# EasyEDA schematic easyEDA.json
TITLE: Sheet_1; REV: 1.0; Date: 2026-10-07; Sheet: 1/1; Drawn By: Farouk; Company: Your Company
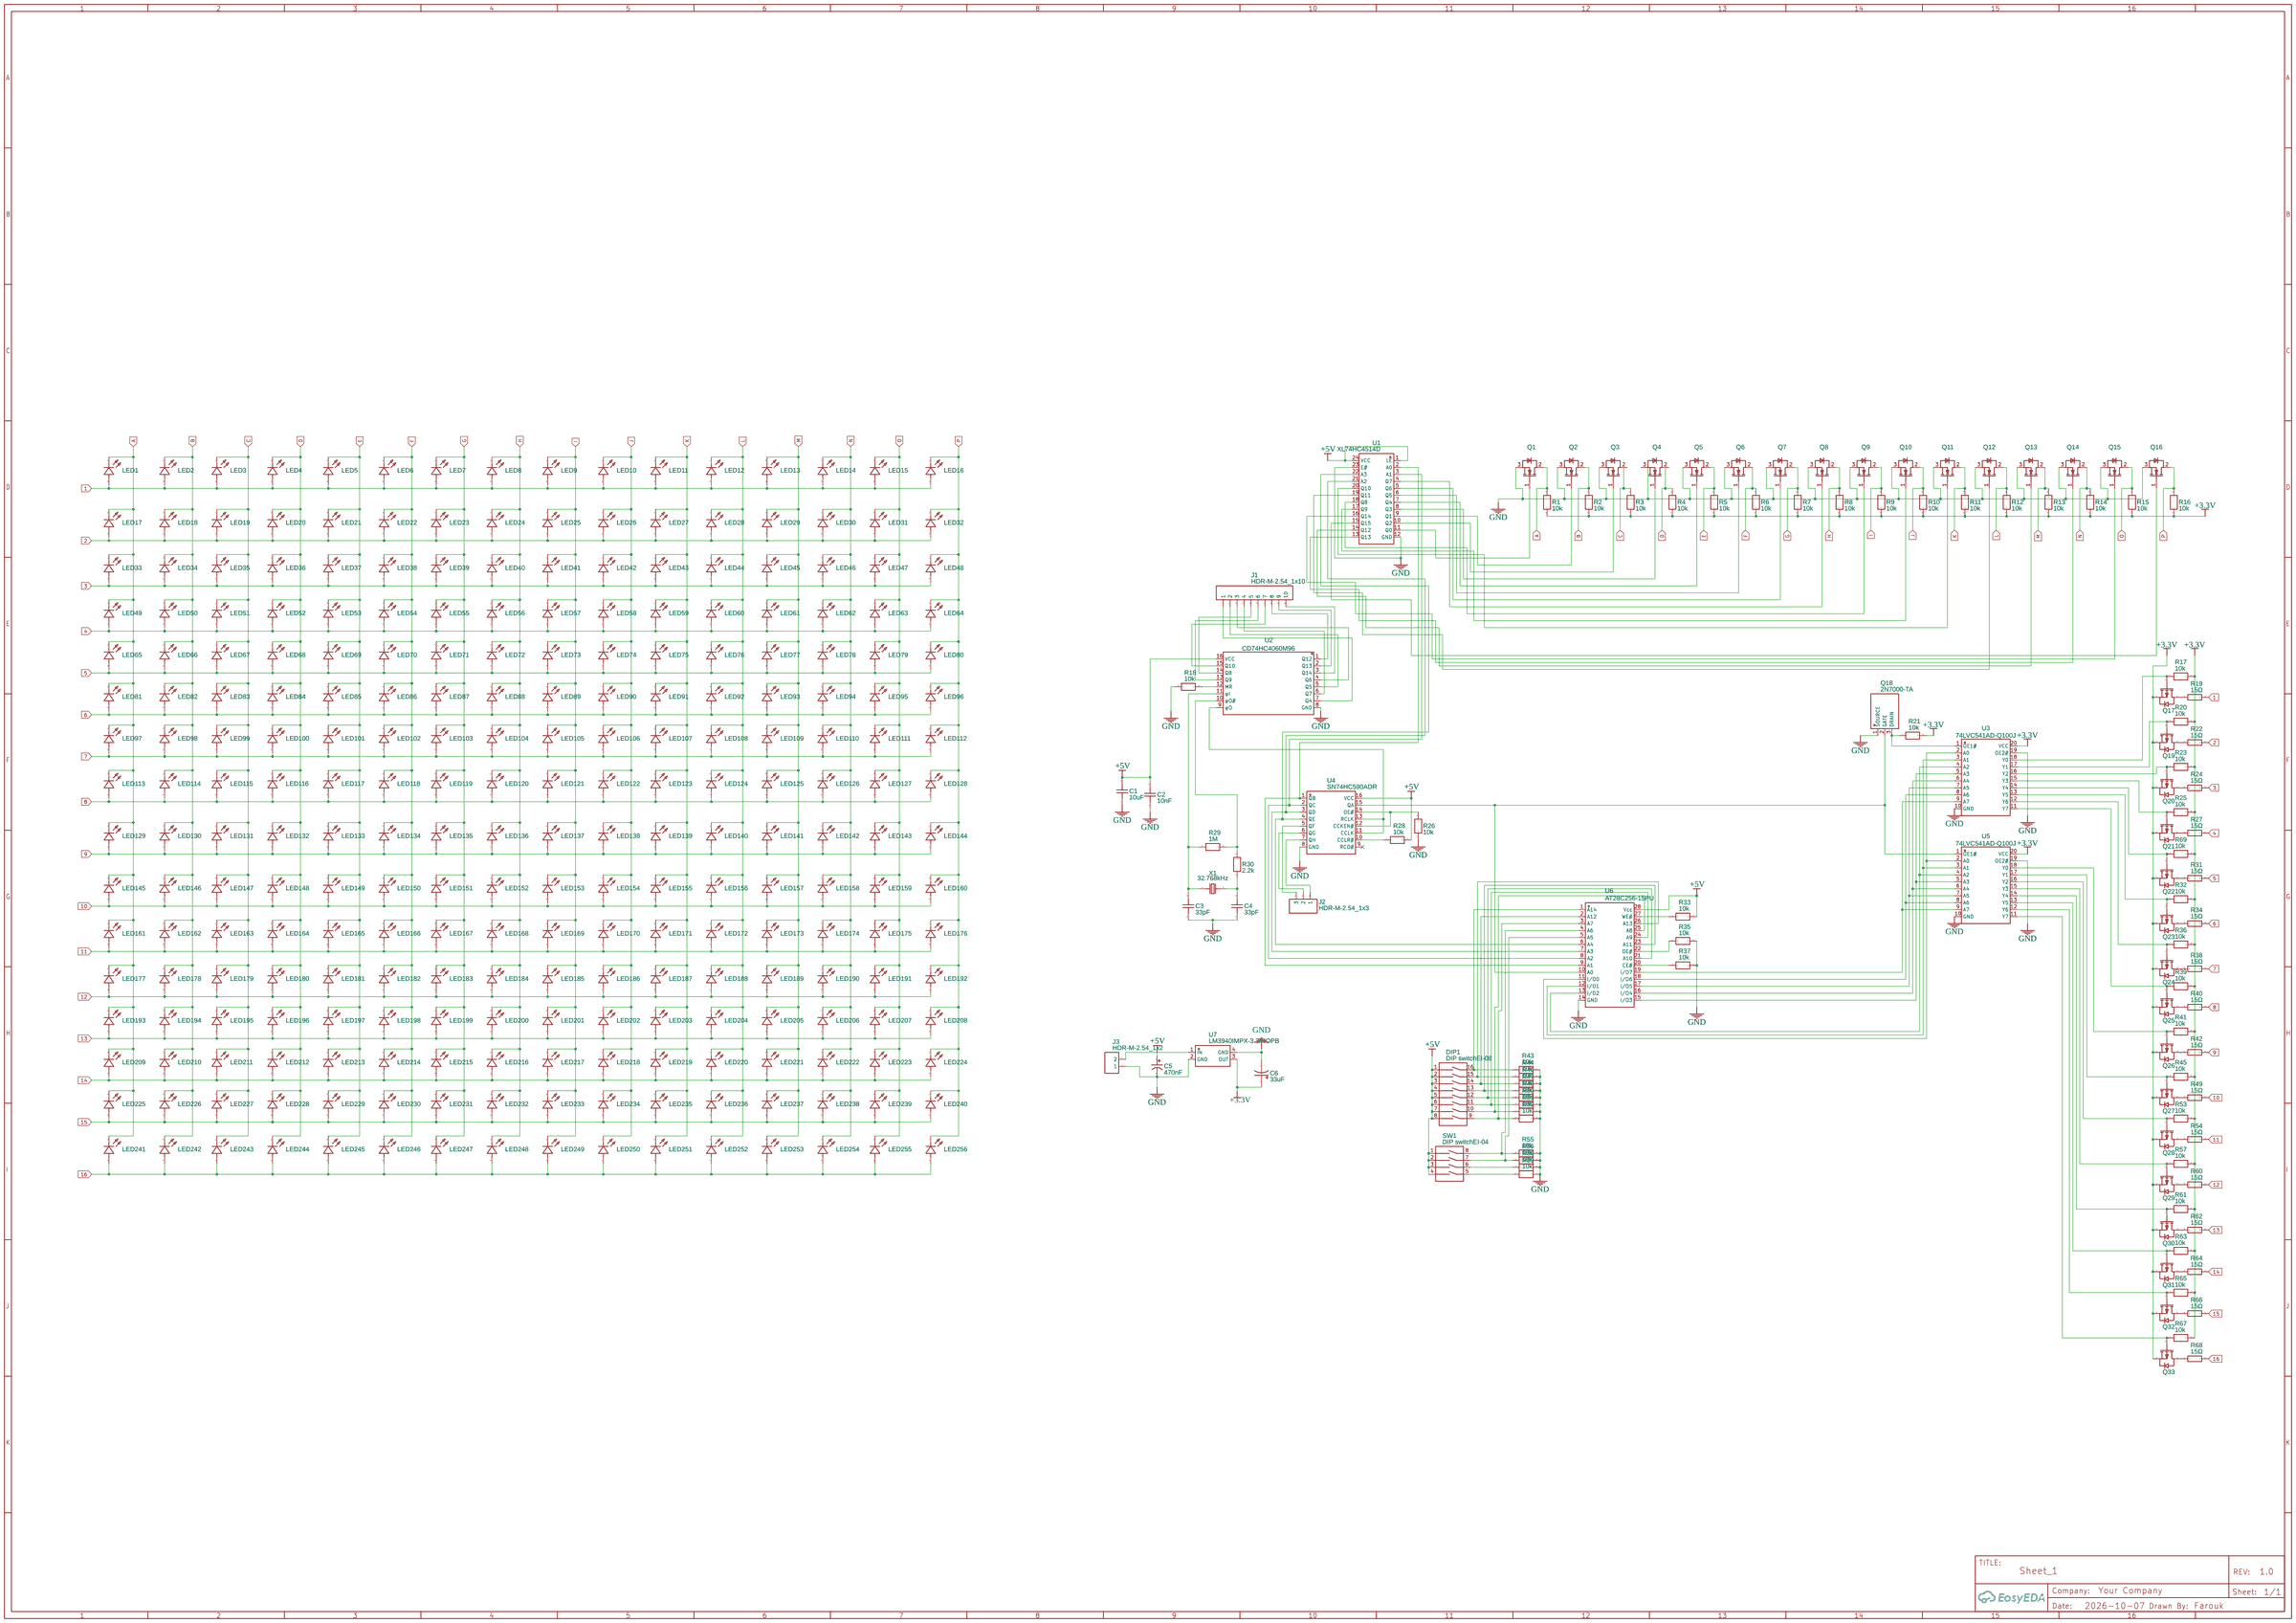
[diagram p0: schematic sheet]

## Parts
C1  10uF  [C1210]
C2  10nF  [C0805]
C3  33pF  [C0805]
C4  33pF  [C0805]
C5  470nF  [CAP-TH_BD4.0-P1.50-D0.8-FD]
C6  33uF  [CAP-TH_BD6.3-P2.50-D0.5-FD]
DIP1  DIP switchEI-08  [SW-TH_16P-L20.5-W6.0-P2.54]
J1  HDR-M-2.54_1x10  [HDR-M-2.54_1X10]
J2  HDR-M-2.54_1x3  [HDR-M-2.54_1X3]
J3  HDR-M-2.54_1x2  [HDR-M-2.54_1X2]
LED1  42-21A/GHC-YX1Y2N/1T  [LED-SMD_L3.2-W2.4-R_GREEN]
LED2  42-21A/GHC-YX1Y2N/1T  [LED-SMD_L3.2-W2.4-R_GREEN]
LED3  42-21A/GHC-YX1Y2N/1T  [LED-SMD_L3.2-W2.4-R_GREEN]
LED4  42-21A/GHC-YX1Y2N/1T  [LED-SMD_L3.2-W2.4-R_GREEN]
LED5  42-21A/GHC-YX1Y2N/1T  [LED-SMD_L3.2-W2.4-R_GREEN]
LED6  42-21A/GHC-YX1Y2N/1T  [LED-SMD_L3.2-W2.4-R_GREEN]
LED7  42-21A/GHC-YX1Y2N/1T  [LED-SMD_L3.2-W2.4-R_GREEN]
LED8  42-21A/GHC-YX1Y2N/1T  [LED-SMD_L3.2-W2.4-R_GREEN]
LED9  42-21A/GHC-YX1Y2N/1T  [LED-SMD_L3.2-W2.4-R_GREEN]
LED10  42-21A/GHC-YX1Y2N/1T  [LED-SMD_L3.2-W2.4-R_GREEN]
LED11  42-21A/GHC-YX1Y2N/1T  [LED-SMD_L3.2-W2.4-R_GREEN]
LED12  42-21A/GHC-YX1Y2N/1T  [LED-SMD_L3.2-W2.4-R_GREEN]
LED13  42-21A/GHC-YX1Y2N/1T  [LED-SMD_L3.2-W2.4-R_GREEN]
LED14  42-21A/GHC-YX1Y2N/1T  [LED-SMD_L3.2-W2.4-R_GREEN]
LED15  42-21A/GHC-YX1Y2N/1T  [LED-SMD_L3.2-W2.4-R_GREEN]
LED16  42-21A/GHC-YX1Y2N/1T  [LED-SMD_L3.2-W2.4-R_GREEN]
LED17  42-21A/GHC-YX1Y2N/1T  [LED-SMD_L3.2-W2.4-R_GREEN]
LED18  42-21A/GHC-YX1Y2N/1T  [LED-SMD_L3.2-W2.4-R_GREEN]
LED19  42-21A/GHC-YX1Y2N/1T  [LED-SMD_L3.2-W2.4-R_GREEN]
LED20  42-21A/GHC-YX1Y2N/1T  [LED-SMD_L3.2-W2.4-R_GREEN]
LED21  42-21A/GHC-YX1Y2N/1T  [LED-SMD_L3.2-W2.4-R_GREEN]
LED22  42-21A/GHC-YX1Y2N/1T  [LED-SMD_L3.2-W2.4-R_GREEN]
LED23  42-21A/GHC-YX1Y2N/1T  [LED-SMD_L3.2-W2.4-R_GREEN]
LED24  42-21A/GHC-YX1Y2N/1T  [LED-SMD_L3.2-W2.4-R_GREEN]
LED25  42-21A/GHC-YX1Y2N/1T  [LED-SMD_L3.2-W2.4-R_GREEN]
LED26  42-21A/GHC-YX1Y2N/1T  [LED-SMD_L3.2-W2.4-R_GREEN]
LED27  42-21A/GHC-YX1Y2N/1T  [LED-SMD_L3.2-W2.4-R_GREEN]
LED28  42-21A/GHC-YX1Y2N/1T  [LED-SMD_L3.2-W2.4-R_GREEN]
LED29  42-21A/GHC-YX1Y2N/1T  [LED-SMD_L3.2-W2.4-R_GREEN]
LED30  42-21A/GHC-YX1Y2N/1T  [LED-SMD_L3.2-W2.4-R_GREEN]
LED31  42-21A/GHC-YX1Y2N/1T  [LED-SMD_L3.2-W2.4-R_GREEN]
LED32  42-21A/GHC-YX1Y2N/1T  [LED-SMD_L3.2-W2.4-R_GREEN]
LED33  42-21A/GHC-YX1Y2N/1T  [LED-SMD_L3.2-W2.4-R_GREEN]
LED34  42-21A/GHC-YX1Y2N/1T  [LED-SMD_L3.2-W2.4-R_GREEN]
LED35  42-21A/GHC-YX1Y2N/1T  [LED-SMD_L3.2-W2.4-R_GREEN]
LED36  42-21A/GHC-YX1Y2N/1T  [LED-SMD_L3.2-W2.4-R_GREEN]
LED37  42-21A/GHC-YX1Y2N/1T  [LED-SMD_L3.2-W2.4-R_GREEN]
LED38  42-21A/GHC-YX1Y2N/1T  [LED-SMD_L3.2-W2.4-R_GREEN]
LED39  42-21A/GHC-YX1Y2N/1T  [LED-SMD_L3.2-W2.4-R_GREEN]
LED40  42-21A/GHC-YX1Y2N/1T  [LED-SMD_L3.2-W2.4-R_GREEN]
LED41  42-21A/GHC-YX1Y2N/1T  [LED-SMD_L3.2-W2.4-R_GREEN]
LED42  42-21A/GHC-YX1Y2N/1T  [LED-SMD_L3.2-W2.4-R_GREEN]
LED43  42-21A/GHC-YX1Y2N/1T  [LED-SMD_L3.2-W2.4-R_GREEN]
LED44  42-21A/GHC-YX1Y2N/1T  [LED-SMD_L3.2-W2.4-R_GREEN]
LED45  42-21A/GHC-YX1Y2N/1T  [LED-SMD_L3.2-W2.4-R_GREEN]
LED46  42-21A/GHC-YX1Y2N/1T  [LED-SMD_L3.2-W2.4-R_GREEN]
LED47  42-21A/GHC-YX1Y2N/1T  [LED-SMD_L3.2-W2.4-R_GREEN]
LED48  42-21A/GHC-YX1Y2N/1T  [LED-SMD_L3.2-W2.4-R_GREEN]
LED49  42-21A/GHC-YX1Y2N/1T  [LED-SMD_L3.2-W2.4-R_GREEN]
LED50  42-21A/GHC-YX1Y2N/1T  [LED-SMD_L3.2-W2.4-R_GREEN]
LED51  42-21A/GHC-YX1Y2N/1T  [LED-SMD_L3.2-W2.4-R_GREEN]
LED52  42-21A/GHC-YX1Y2N/1T  [LED-SMD_L3.2-W2.4-R_GREEN]
LED53  42-21A/GHC-YX1Y2N/1T  [LED-SMD_L3.2-W2.4-R_GREEN]
LED54  42-21A/GHC-YX1Y2N/1T  [LED-SMD_L3.2-W2.4-R_GREEN]
LED55  42-21A/GHC-YX1Y2N/1T  [LED-SMD_L3.2-W2.4-R_GREEN]
LED56  42-21A/GHC-YX1Y2N/1T  [LED-SMD_L3.2-W2.4-R_GREEN]
LED57  42-21A/GHC-YX1Y2N/1T  [LED-SMD_L3.2-W2.4-R_GREEN]
LED58  42-21A/GHC-YX1Y2N/1T  [LED-SMD_L3.2-W2.4-R_GREEN]
LED59  42-21A/GHC-YX1Y2N/1T  [LED-SMD_L3.2-W2.4-R_GREEN]
LED60  42-21A/GHC-YX1Y2N/1T  [LED-SMD_L3.2-W2.4-R_GREEN]
LED61  42-21A/GHC-YX1Y2N/1T  [LED-SMD_L3.2-W2.4-R_GREEN]
LED62  42-21A/GHC-YX1Y2N/1T  [LED-SMD_L3.2-W2.4-R_GREEN]
LED63  42-21A/GHC-YX1Y2N/1T  [LED-SMD_L3.2-W2.4-R_GREEN]
LED64  42-21A/GHC-YX1Y2N/1T  [LED-SMD_L3.2-W2.4-R_GREEN]
LED65  42-21A/GHC-YX1Y2N/1T  [LED-SMD_L3.2-W2.4-R_GREEN]
LED66  42-21A/GHC-YX1Y2N/1T  [LED-SMD_L3.2-W2.4-R_GREEN]
LED67  42-21A/GHC-YX1Y2N/1T  [LED-SMD_L3.2-W2.4-R_GREEN]
LED68  42-21A/GHC-YX1Y2N/1T  [LED-SMD_L3.2-W2.4-R_GREEN]
LED69  42-21A/GHC-YX1Y2N/1T  [LED-SMD_L3.2-W2.4-R_GREEN]
LED70  42-21A/GHC-YX1Y2N/1T  [LED-SMD_L3.2-W2.4-R_GREEN]
LED71  42-21A/GHC-YX1Y2N/1T  [LED-SMD_L3.2-W2.4-R_GREEN]
LED72  42-21A/GHC-YX1Y2N/1T  [LED-SMD_L3.2-W2.4-R_GREEN]
LED73  42-21A/GHC-YX1Y2N/1T  [LED-SMD_L3.2-W2.4-R_GREEN]
LED74  42-21A/GHC-YX1Y2N/1T  [LED-SMD_L3.2-W2.4-R_GREEN]
LED75  42-21A/GHC-YX1Y2N/1T  [LED-SMD_L3.2-W2.4-R_GREEN]
LED76  42-21A/GHC-YX1Y2N/1T  [LED-SMD_L3.2-W2.4-R_GREEN]
LED77  42-21A/GHC-YX1Y2N/1T  [LED-SMD_L3.2-W2.4-R_GREEN]
LED78  42-21A/GHC-YX1Y2N/1T  [LED-SMD_L3.2-W2.4-R_GREEN]
LED79  42-21A/GHC-YX1Y2N/1T  [LED-SMD_L3.2-W2.4-R_GREEN]
LED80  42-21A/GHC-YX1Y2N/1T  [LED-SMD_L3.2-W2.4-R_GREEN]
LED81  42-21A/GHC-YX1Y2N/1T  [LED-SMD_L3.2-W2.4-R_GREEN]
LED82  42-21A/GHC-YX1Y2N/1T  [LED-SMD_L3.2-W2.4-R_GREEN]
LED83  42-21A/GHC-YX1Y2N/1T  [LED-SMD_L3.2-W2.4-R_GREEN]
LED84  42-21A/GHC-YX1Y2N/1T  [LED-SMD_L3.2-W2.4-R_GREEN]
LED85  42-21A/GHC-YX1Y2N/1T  [LED-SMD_L3.2-W2.4-R_GREEN]
LED86  42-21A/GHC-YX1Y2N/1T  [LED-SMD_L3.2-W2.4-R_GREEN]
LED87  42-21A/GHC-YX1Y2N/1T  [LED-SMD_L3.2-W2.4-R_GREEN]
LED88  42-21A/GHC-YX1Y2N/1T  [LED-SMD_L3.2-W2.4-R_GREEN]
LED89  42-21A/GHC-YX1Y2N/1T  [LED-SMD_L3.2-W2.4-R_GREEN]
LED90  42-21A/GHC-YX1Y2N/1T  [LED-SMD_L3.2-W2.4-R_GREEN]
LED91  42-21A/GHC-YX1Y2N/1T  [LED-SMD_L3.2-W2.4-R_GREEN]
LED92  42-21A/GHC-YX1Y2N/1T  [LED-SMD_L3.2-W2.4-R_GREEN]
LED93  42-21A/GHC-YX1Y2N/1T  [LED-SMD_L3.2-W2.4-R_GREEN]
LED94  42-21A/GHC-YX1Y2N/1T  [LED-SMD_L3.2-W2.4-R_GREEN]
LED95  42-21A/GHC-YX1Y2N/1T  [LED-SMD_L3.2-W2.4-R_GREEN]
LED96  42-21A/GHC-YX1Y2N/1T  [LED-SMD_L3.2-W2.4-R_GREEN]
LED97  42-21A/GHC-YX1Y2N/1T  [LED-SMD_L3.2-W2.4-R_GREEN]
LED98  42-21A/GHC-YX1Y2N/1T  [LED-SMD_L3.2-W2.4-R_GREEN]
LED99  42-21A/GHC-YX1Y2N/1T  [LED-SMD_L3.2-W2.4-R_GREEN]
LED100  42-21A/GHC-YX1Y2N/1T  [LED-SMD_L3.2-W2.4-R_GREEN]
LED101  42-21A/GHC-YX1Y2N/1T  [LED-SMD_L3.2-W2.4-R_GREEN]
LED102  42-21A/GHC-YX1Y2N/1T  [LED-SMD_L3.2-W2.4-R_GREEN]
LED103  42-21A/GHC-YX1Y2N/1T  [LED-SMD_L3.2-W2.4-R_GREEN]
LED104  42-21A/GHC-YX1Y2N/1T  [LED-SMD_L3.2-W2.4-R_GREEN]
LED105  42-21A/GHC-YX1Y2N/1T  [LED-SMD_L3.2-W2.4-R_GREEN]
LED106  42-21A/GHC-YX1Y2N/1T  [LED-SMD_L3.2-W2.4-R_GREEN]
LED107  42-21A/GHC-YX1Y2N/1T  [LED-SMD_L3.2-W2.4-R_GREEN]
LED108  42-21A/GHC-YX1Y2N/1T  [LED-SMD_L3.2-W2.4-R_GREEN]
LED109  42-21A/GHC-YX1Y2N/1T  [LED-SMD_L3.2-W2.4-R_GREEN]
LED110  42-21A/GHC-YX1Y2N/1T  [LED-SMD_L3.2-W2.4-R_GREEN]
LED111  42-21A/GHC-YX1Y2N/1T  [LED-SMD_L3.2-W2.4-R_GREEN]
LED112  42-21A/GHC-YX1Y2N/1T  [LED-SMD_L3.2-W2.4-R_GREEN]
LED113  42-21A/GHC-YX1Y2N/1T  [LED-SMD_L3.2-W2.4-R_GREEN]
LED114  42-21A/GHC-YX1Y2N/1T  [LED-SMD_L3.2-W2.4-R_GREEN]
LED115  42-21A/GHC-YX1Y2N/1T  [LED-SMD_L3.2-W2.4-R_GREEN]
LED116  42-21A/GHC-YX1Y2N/1T  [LED-SMD_L3.2-W2.4-R_GREEN]
LED117  42-21A/GHC-YX1Y2N/1T  [LED-SMD_L3.2-W2.4-R_GREEN]
LED118  42-21A/GHC-YX1Y2N/1T  [LED-SMD_L3.2-W2.4-R_GREEN]
LED119  42-21A/GHC-YX1Y2N/1T  [LED-SMD_L3.2-W2.4-R_GREEN]
LED120  42-21A/GHC-YX1Y2N/1T  [LED-SMD_L3.2-W2.4-R_GREEN]
LED121  42-21A/GHC-YX1Y2N/1T  [LED-SMD_L3.2-W2.4-R_GREEN]
LED122  42-21A/GHC-YX1Y2N/1T  [LED-SMD_L3.2-W2.4-R_GREEN]
LED123  42-21A/GHC-YX1Y2N/1T  [LED-SMD_L3.2-W2.4-R_GREEN]
LED124  42-21A/GHC-YX1Y2N/1T  [LED-SMD_L3.2-W2.4-R_GREEN]
LED125  42-21A/GHC-YX1Y2N/1T  [LED-SMD_L3.2-W2.4-R_GREEN]
LED126  42-21A/GHC-YX1Y2N/1T  [LED-SMD_L3.2-W2.4-R_GREEN]
LED127  42-21A/GHC-YX1Y2N/1T  [LED-SMD_L3.2-W2.4-R_GREEN]
LED128  42-21A/GHC-YX1Y2N/1T  [LED-SMD_L3.2-W2.4-R_GREEN]
LED129  42-21A/GHC-YX1Y2N/1T  [LED-SMD_L3.2-W2.4-R_GREEN]
LED130  42-21A/GHC-YX1Y2N/1T  [LED-SMD_L3.2-W2.4-R_GREEN]
LED131  42-21A/GHC-YX1Y2N/1T  [LED-SMD_L3.2-W2.4-R_GREEN]
LED132  42-21A/GHC-YX1Y2N/1T  [LED-SMD_L3.2-W2.4-R_GREEN]
LED133  42-21A/GHC-YX1Y2N/1T  [LED-SMD_L3.2-W2.4-R_GREEN]
LED134  42-21A/GHC-YX1Y2N/1T  [LED-SMD_L3.2-W2.4-R_GREEN]
LED135  42-21A/GHC-YX1Y2N/1T  [LED-SMD_L3.2-W2.4-R_GREEN]
LED136  42-21A/GHC-YX1Y2N/1T  [LED-SMD_L3.2-W2.4-R_GREEN]
LED137  42-21A/GHC-YX1Y2N/1T  [LED-SMD_L3.2-W2.4-R_GREEN]
LED138  42-21A/GHC-YX1Y2N/1T  [LED-SMD_L3.2-W2.4-R_GREEN]
LED139  42-21A/GHC-YX1Y2N/1T  [LED-SMD_L3.2-W2.4-R_GREEN]
LED140  42-21A/GHC-YX1Y2N/1T  [LED-SMD_L3.2-W2.4-R_GREEN]
LED141  42-21A/GHC-YX1Y2N/1T  [LED-SMD_L3.2-W2.4-R_GREEN]
LED142  42-21A/GHC-YX1Y2N/1T  [LED-SMD_L3.2-W2.4-R_GREEN]
LED143  42-21A/GHC-YX1Y2N/1T  [LED-SMD_L3.2-W2.4-R_GREEN]
LED144  42-21A/GHC-YX1Y2N/1T  [LED-SMD_L3.2-W2.4-R_GREEN]
LED145  42-21A/GHC-YX1Y2N/1T  [LED-SMD_L3.2-W2.4-R_GREEN]
LED146  42-21A/GHC-YX1Y2N/1T  [LED-SMD_L3.2-W2.4-R_GREEN]
LED147  42-21A/GHC-YX1Y2N/1T  [LED-SMD_L3.2-W2.4-R_GREEN]
LED148  42-21A/GHC-YX1Y2N/1T  [LED-SMD_L3.2-W2.4-R_GREEN]
LED149  42-21A/GHC-YX1Y2N/1T  [LED-SMD_L3.2-W2.4-R_GREEN]
LED150  42-21A/GHC-YX1Y2N/1T  [LED-SMD_L3.2-W2.4-R_GREEN]
LED151  42-21A/GHC-YX1Y2N/1T  [LED-SMD_L3.2-W2.4-R_GREEN]
LED152  42-21A/GHC-YX1Y2N/1T  [LED-SMD_L3.2-W2.4-R_GREEN]
LED153  42-21A/GHC-YX1Y2N/1T  [LED-SMD_L3.2-W2.4-R_GREEN]
LED154  42-21A/GHC-YX1Y2N/1T  [LED-SMD_L3.2-W2.4-R_GREEN]
LED155  42-21A/GHC-YX1Y2N/1T  [LED-SMD_L3.2-W2.4-R_GREEN]
LED156  42-21A/GHC-YX1Y2N/1T  [LED-SMD_L3.2-W2.4-R_GREEN]
LED157  42-21A/GHC-YX1Y2N/1T  [LED-SMD_L3.2-W2.4-R_GREEN]
LED158  42-21A/GHC-YX1Y2N/1T  [LED-SMD_L3.2-W2.4-R_GREEN]
LED159  42-21A/GHC-YX1Y2N/1T  [LED-SMD_L3.2-W2.4-R_GREEN]
LED160  42-21A/GHC-YX1Y2N/1T  [LED-SMD_L3.2-W2.4-R_GREEN]
LED161  42-21A/GHC-YX1Y2N/1T  [LED-SMD_L3.2-W2.4-R_GREEN]
LED162  42-21A/GHC-YX1Y2N/1T  [LED-SMD_L3.2-W2.4-R_GREEN]
LED163  42-21A/GHC-YX1Y2N/1T  [LED-SMD_L3.2-W2.4-R_GREEN]
LED164  42-21A/GHC-YX1Y2N/1T  [LED-SMD_L3.2-W2.4-R_GREEN]
LED165  42-21A/GHC-YX1Y2N/1T  [LED-SMD_L3.2-W2.4-R_GREEN]
LED166  42-21A/GHC-YX1Y2N/1T  [LED-SMD_L3.2-W2.4-R_GREEN]
LED167  42-21A/GHC-YX1Y2N/1T  [LED-SMD_L3.2-W2.4-R_GREEN]
LED168  42-21A/GHC-YX1Y2N/1T  [LED-SMD_L3.2-W2.4-R_GREEN]
LED169  42-21A/GHC-YX1Y2N/1T  [LED-SMD_L3.2-W2.4-R_GREEN]
LED170  42-21A/GHC-YX1Y2N/1T  [LED-SMD_L3.2-W2.4-R_GREEN]
LED171  42-21A/GHC-YX1Y2N/1T  [LED-SMD_L3.2-W2.4-R_GREEN]
LED172  42-21A/GHC-YX1Y2N/1T  [LED-SMD_L3.2-W2.4-R_GREEN]
LED173  42-21A/GHC-YX1Y2N/1T  [LED-SMD_L3.2-W2.4-R_GREEN]
LED174  42-21A/GHC-YX1Y2N/1T  [LED-SMD_L3.2-W2.4-R_GREEN]
LED175  42-21A/GHC-YX1Y2N/1T  [LED-SMD_L3.2-W2.4-R_GREEN]
LED176  42-21A/GHC-YX1Y2N/1T  [LED-SMD_L3.2-W2.4-R_GREEN]
LED177  42-21A/GHC-YX1Y2N/1T  [LED-SMD_L3.2-W2.4-R_GREEN]
LED178  42-21A/GHC-YX1Y2N/1T  [LED-SMD_L3.2-W2.4-R_GREEN]
LED179  42-21A/GHC-YX1Y2N/1T  [LED-SMD_L3.2-W2.4-R_GREEN]
LED180  42-21A/GHC-YX1Y2N/1T  [LED-SMD_L3.2-W2.4-R_GREEN]
LED181  42-21A/GHC-YX1Y2N/1T  [LED-SMD_L3.2-W2.4-R_GREEN]
LED182  42-21A/GHC-YX1Y2N/1T  [LED-SMD_L3.2-W2.4-R_GREEN]
LED183  42-21A/GHC-YX1Y2N/1T  [LED-SMD_L3.2-W2.4-R_GREEN]
LED184  42-21A/GHC-YX1Y2N/1T  [LED-SMD_L3.2-W2.4-R_GREEN]
LED185  42-21A/GHC-YX1Y2N/1T  [LED-SMD_L3.2-W2.4-R_GREEN]
LED186  42-21A/GHC-YX1Y2N/1T  [LED-SMD_L3.2-W2.4-R_GREEN]
LED187  42-21A/GHC-YX1Y2N/1T  [LED-SMD_L3.2-W2.4-R_GREEN]
LED188  42-21A/GHC-YX1Y2N/1T  [LED-SMD_L3.2-W2.4-R_GREEN]
LED189  42-21A/GHC-YX1Y2N/1T  [LED-SMD_L3.2-W2.4-R_GREEN]
LED190  42-21A/GHC-YX1Y2N/1T  [LED-SMD_L3.2-W2.4-R_GREEN]
LED191  42-21A/GHC-YX1Y2N/1T  [LED-SMD_L3.2-W2.4-R_GREEN]
LED192  42-21A/GHC-YX1Y2N/1T  [LED-SMD_L3.2-W2.4-R_GREEN]
LED193  42-21A/GHC-YX1Y2N/1T  [LED-SMD_L3.2-W2.4-R_GREEN]
LED194  42-21A/GHC-YX1Y2N/1T  [LED-SMD_L3.2-W2.4-R_GREEN]
LED195  42-21A/GHC-YX1Y2N/1T  [LED-SMD_L3.2-W2.4-R_GREEN]
LED196  42-21A/GHC-YX1Y2N/1T  [LED-SMD_L3.2-W2.4-R_GREEN]
LED197  42-21A/GHC-YX1Y2N/1T  [LED-SMD_L3.2-W2.4-R_GREEN]
LED198  42-21A/GHC-YX1Y2N/1T  [LED-SMD_L3.2-W2.4-R_GREEN]
LED199  42-21A/GHC-YX1Y2N/1T  [LED-SMD_L3.2-W2.4-R_GREEN]
LED200  42-21A/GHC-YX1Y2N/1T  [LED-SMD_L3.2-W2.4-R_GREEN]
LED201  42-21A/GHC-YX1Y2N/1T  [LED-SMD_L3.2-W2.4-R_GREEN]
LED202  42-21A/GHC-YX1Y2N/1T  [LED-SMD_L3.2-W2.4-R_GREEN]
LED203  42-21A/GHC-YX1Y2N/1T  [LED-SMD_L3.2-W2.4-R_GREEN]
LED204  42-21A/GHC-YX1Y2N/1T  [LED-SMD_L3.2-W2.4-R_GREEN]
LED205  42-21A/GHC-YX1Y2N/1T  [LED-SMD_L3.2-W2.4-R_GREEN]
LED206  42-21A/GHC-YX1Y2N/1T  [LED-SMD_L3.2-W2.4-R_GREEN]
LED207  42-21A/GHC-YX1Y2N/1T  [LED-SMD_L3.2-W2.4-R_GREEN]
LED208  42-21A/GHC-YX1Y2N/1T  [LED-SMD_L3.2-W2.4-R_GREEN]
LED209  42-21A/GHC-YX1Y2N/1T  [LED-SMD_L3.2-W2.4-R_GREEN]
LED210  42-21A/GHC-YX1Y2N/1T  [LED-SMD_L3.2-W2.4-R_GREEN]
LED211  42-21A/GHC-YX1Y2N/1T  [LED-SMD_L3.2-W2.4-R_GREEN]
LED212  42-21A/GHC-YX1Y2N/1T  [LED-SMD_L3.2-W2.4-R_GREEN]
LED213  42-21A/GHC-YX1Y2N/1T  [LED-SMD_L3.2-W2.4-R_GREEN]
LED214  42-21A/GHC-YX1Y2N/1T  [LED-SMD_L3.2-W2.4-R_GREEN]
LED215  42-21A/GHC-YX1Y2N/1T  [LED-SMD_L3.2-W2.4-R_GREEN]
LED216  42-21A/GHC-YX1Y2N/1T  [LED-SMD_L3.2-W2.4-R_GREEN]
LED217  42-21A/GHC-YX1Y2N/1T  [LED-SMD_L3.2-W2.4-R_GREEN]
LED218  42-21A/GHC-YX1Y2N/1T  [LED-SMD_L3.2-W2.4-R_GREEN]
LED219  42-21A/GHC-YX1Y2N/1T  [LED-SMD_L3.2-W2.4-R_GREEN]
LED220  42-21A/GHC-YX1Y2N/1T  [LED-SMD_L3.2-W2.4-R_GREEN]
LED221  42-21A/GHC-YX1Y2N/1T  [LED-SMD_L3.2-W2.4-R_GREEN]
LED222  42-21A/GHC-YX1Y2N/1T  [LED-SMD_L3.2-W2.4-R_GREEN]
LED223  42-21A/GHC-YX1Y2N/1T  [LED-SMD_L3.2-W2.4-R_GREEN]
LED224  42-21A/GHC-YX1Y2N/1T  [LED-SMD_L3.2-W2.4-R_GREEN]
LED225  42-21A/GHC-YX1Y2N/1T  [LED-SMD_L3.2-W2.4-R_GREEN]
LED226  42-21A/GHC-YX1Y2N/1T  [LED-SMD_L3.2-W2.4-R_GREEN]
LED227  42-21A/GHC-YX1Y2N/1T  [LED-SMD_L3.2-W2.4-R_GREEN]
LED228  42-21A/GHC-YX1Y2N/1T  [LED-SMD_L3.2-W2.4-R_GREEN]
LED229  42-21A/GHC-YX1Y2N/1T  [LED-SMD_L3.2-W2.4-R_GREEN]
LED230  42-21A/GHC-YX1Y2N/1T  [LED-SMD_L3.2-W2.4-R_GREEN]
LED231  42-21A/GHC-YX1Y2N/1T  [LED-SMD_L3.2-W2.4-R_GREEN]
LED232  42-21A/GHC-YX1Y2N/1T  [LED-SMD_L3.2-W2.4-R_GREEN]
LED233  42-21A/GHC-YX1Y2N/1T  [LED-SMD_L3.2-W2.4-R_GREEN]
LED234  42-21A/GHC-YX1Y2N/1T  [LED-SMD_L3.2-W2.4-R_GREEN]
LED235  42-21A/GHC-YX1Y2N/1T  [LED-SMD_L3.2-W2.4-R_GREEN]
LED236  42-21A/GHC-YX1Y2N/1T  [LED-SMD_L3.2-W2.4-R_GREEN]
LED237  42-21A/GHC-YX1Y2N/1T  [LED-SMD_L3.2-W2.4-R_GREEN]
LED238  42-21A/GHC-YX1Y2N/1T  [LED-SMD_L3.2-W2.4-R_GREEN]
LED239  42-21A/GHC-YX1Y2N/1T  [LED-SMD_L3.2-W2.4-R_GREEN]
LED240  42-21A/GHC-YX1Y2N/1T  [LED-SMD_L3.2-W2.4-R_GREEN]
LED241  42-21A/GHC-YX1Y2N/1T  [LED-SMD_L3.2-W2.4-R_GREEN]
LED242  42-21A/GHC-YX1Y2N/1T  [LED-SMD_L3.2-W2.4-R_GREEN]
LED243  42-21A/GHC-YX1Y2N/1T  [LED-SMD_L3.2-W2.4-R_GREEN]
LED244  42-21A/GHC-YX1Y2N/1T  [LED-SMD_L3.2-W2.4-R_GREEN]
LED245  42-21A/GHC-YX1Y2N/1T  [LED-SMD_L3.2-W2.4-R_GREEN]
LED246  42-21A/GHC-YX1Y2N/1T  [LED-SMD_L3.2-W2.4-R_GREEN]
LED247  42-21A/GHC-YX1Y2N/1T  [LED-SMD_L3.2-W2.4-R_GREEN]
LED248  42-21A/GHC-YX1Y2N/1T  [LED-SMD_L3.2-W2.4-R_GREEN]
LED249  42-21A/GHC-YX1Y2N/1T  [LED-SMD_L3.2-W2.4-R_GREEN]
LED250  42-21A/GHC-YX1Y2N/1T  [LED-SMD_L3.2-W2.4-R_GREEN]
LED251  42-21A/GHC-YX1Y2N/1T  [LED-SMD_L3.2-W2.4-R_GREEN]
LED252  42-21A/GHC-YX1Y2N/1T  [LED-SMD_L3.2-W2.4-R_GREEN]
LED253  42-21A/GHC-YX1Y2N/1T  [LED-SMD_L3.2-W2.4-R_GREEN]
LED254  42-21A/GHC-YX1Y2N/1T  [LED-SMD_L3.2-W2.4-R_GREEN]
LED255  42-21A/GHC-YX1Y2N/1T  [LED-SMD_L3.2-W2.4-R_GREEN]
LED256  42-21A/GHC-YX1Y2N/1T  [LED-SMD_L3.2-W2.4-R_GREEN]
Q1  IRLZ44NPBF-MNS  [TO-220-3_L10.0-W4.5-P2.54-L]
Q2  IRLZ44NPBF-MNS  [TO-220-3_L10.0-W4.5-P2.54-L]
Q3  IRLZ44NPBF-MNS  [TO-220-3_L10.0-W4.5-P2.54-L]
Q4  IRLZ44NPBF-MNS  [TO-220-3_L10.0-W4.5-P2.54-L]
Q5  IRLZ44NPBF-MNS  [TO-220-3_L10.0-W4.5-P2.54-L]
Q6  IRLZ44NPBF-MNS  [TO-220-3_L10.0-W4.5-P2.54-L]
Q7  IRLZ44NPBF-MNS  [TO-220-3_L10.0-W4.5-P2.54-L]
Q8  IRLZ44NPBF-MNS  [TO-220-3_L10.0-W4.5-P2.54-L]
Q9  IRLZ44NPBF-MNS  [TO-220-3_L10.0-W4.5-P2.54-L]
Q10  IRLZ44NPBF-MNS  [TO-220-3_L10.0-W4.5-P2.54-L]
Q11  IRLZ44NPBF-MNS  [TO-220-3_L10.0-W4.5-P2.54-L]
Q12  IRLZ44NPBF-MNS  [TO-220-3_L10.0-W4.5-P2.54-L]
Q13  IRLZ44NPBF-MNS  [TO-220-3_L10.0-W4.5-P2.54-L]
Q14  IRLZ44NPBF-MNS  [TO-220-3_L10.0-W4.5-P2.54-L]
Q15  IRLZ44NPBF-MNS  [TO-220-3_L10.0-W4.5-P2.54-L]
Q16  IRLZ44NPBF-MNS  [TO-220-3_L10.0-W4.5-P2.54-L]
Q17  AO3401CI-ES  [SOT-23-3_L2.9-W1.3-P1.90-LS2.4-BR]
Q18  2N7000-TA  [TO-92-3_L4.5-W3.5-P1.27-L]
Q19  AO3401CI-ES  [SOT-23-3_L2.9-W1.3-P1.90-LS2.4-BR]
Q20  AO3401CI-ES  [SOT-23-3_L2.9-W1.3-P1.90-LS2.4-BR]
Q21  AO3401CI-ES  [SOT-23-3_L2.9-W1.3-P1.90-LS2.4-BR]
Q22  AO3401CI-ES  [SOT-23-3_L2.9-W1.3-P1.90-LS2.4-BR]
Q23  AO3401CI-ES  [SOT-23-3_L2.9-W1.3-P1.90-LS2.4-BR]
Q24  AO3401CI-ES  [SOT-23-3_L2.9-W1.3-P1.90-LS2.4-BR]
Q25  AO3401CI-ES  [SOT-23-3_L2.9-W1.3-P1.90-LS2.4-BR]
Q26  AO3401CI-ES  [SOT-23-3_L2.9-W1.3-P1.90-LS2.4-BR]
Q27  AO3401CI-ES  [SOT-23-3_L2.9-W1.3-P1.90-LS2.4-BR]
Q28  AO3401CI-ES  [SOT-23-3_L2.9-W1.3-P1.90-LS2.4-BR]
Q29  AO3401CI-ES  [SOT-23-3_L2.9-W1.3-P1.90-LS2.4-BR]
Q30  AO3401CI-ES  [SOT-23-3_L2.9-W1.3-P1.90-LS2.4-BR]
Q31  AO3401CI-ES  [SOT-23-3_L2.9-W1.3-P1.90-LS2.4-BR]
Q32  AO3401CI-ES  [SOT-23-3_L2.9-W1.3-P1.90-LS2.4-BR]
Q33  AO3401CI-ES  [SOT-23-3_L2.9-W1.3-P1.90-LS2.4-BR]
R1  10k  [R0603]
R2  10k  [R0603]
R3  10k  [R0603]
R4  10k  [R0603]
R5  10k  [R0603]
R6  10k  [R0603]
R7  10k  [R0603]
R8  10k  [R0603]
R9  10k  [R0603]
R10  10k  [R0603]
R11  10k  [R0603]
R12  10k  [R0603]
R13  10k  [R0603]
R14  10k  [R0603]
R15  10k  [R0603]
R16  10k  [R0603]
R17  10k  [R0603]
R18  10k  [R0603]
R19  15Ω  [RES-TH_BD2.3-L6.5-P10.50-D0.5]
R20  10k  [R0603]
R21  10k  [R0603]
R22  15Ω  [RES-TH_BD2.3-L6.5-P10.50-D0.5]
R23  10k  [R0603]
R24  15Ω  [RES-TH_BD2.3-L6.5-P10.50-D0.5]
R25  10k  [R0603]
R26  10k  [R0603]
R27  15Ω  [RES-TH_BD2.3-L6.5-P10.50-D0.5]
R28  10k  [R0603]
R29  1M  [R0603]
R30  2.2k  [R0603]
R31  15Ω  [RES-TH_BD2.3-L6.5-P10.50-D0.5]
R32  10k  [R0603]
R33  10k  [R0603]
R34  15Ω  [RES-TH_BD2.3-L6.5-P10.50-D0.5]
R35  10k  [R0603]
R36  10k  [R0603]
R37  10k  [R0603]
R38  15Ω  [RES-TH_BD2.3-L6.5-P10.50-D0.5]
R39  10k  [R0603]
R40  15Ω  [RES-TH_BD2.3-L6.5-P10.50-D0.5]
R41  10k  [R0603]
R42  15Ω  [RES-TH_BD2.3-L6.5-P10.50-D0.5]
R43  10k  [R0603]
R44  10k  [R0603]
R45  10k  [R0603]
R46  10k  [R0603]
R47  10k  [R0603]
R48  10k  [R0603]
R49  15Ω  [RES-TH_BD2.3-L6.5-P10.50-D0.5]
R50  10k  [R0603]
R51  10k  [R0603]
R52  10k  [R0603]
R53  10k  [R0603]
R54  15Ω  [RES-TH_BD2.3-L6.5-P10.50-D0.5]
R55  10k  [R0603]
R56  10k  [R0603]
R57  10k  [R0603]
R58  10k  [R0603]
R59  10k  [R0603]
R60  15Ω  [RES-TH_BD2.3-L6.5-P10.50-D0.5]
R61  10k  [R0603]
R62  15Ω  [RES-TH_BD2.3-L6.5-P10.50-D0.5]
R63  10k  [R0603]
R64  15Ω  [RES-TH_BD2.3-L6.5-P10.50-D0.5]
R65  10k  [R0603]
R66  15Ω  [RES-TH_BD2.3-L6.5-P10.50-D0.5]
R67  10k  [R0603]
R68  15Ω  [RES-TH_BD2.3-L6.5-P10.50-D0.5]
R69  10k  [R0603]
SW1  DIP switchEI-04  [SW-TH_DIPSWITCHEI-04]
U1  XL74HC4514D  [SOP-24_L15.3-W7.6-LS10.3-P1.27-BL]
U2  CD74HC4060M96  [SOIC-16_L10.8-W4.5-P1.27-LS6.8-BL]
U3  74LVC541AD-Q100J  [SO-20_L12.8-W7.5-P1.27-LS10.3-BL]
U4  SN74HC590ADR  [SOIC-16_L9.9-W3.9-P1.27-LS6.0-BL]
U5  74LVC541AD-Q100J  [SO-20_L12.8-W7.5-P1.27-LS10.3-BL]
U6  AT28C256-15PU  [PDIP-28_L37.0-W13.5-P2.54-LS15.6-BL]
U7  LM3940IMPX-3.3/NOPB  [SOT-223-4_L6.5-W3.5-P2.30-LS7.0-BR]
X1  32.768kHz  [DT-38_BD3.1-P1.1]

## Library data of the parts
C1 = CC1210Y5V16V106ZN: Supplier: LCSC; Supplier Part: C54916872; Manufacturer: TORCH(火炬); Contributor: lcsc; JLCPCB Part Class: Extended Part
C2 = CSA0805C0G103J500MT: Supplier: LCSC; Supplier Part: C49270298; Manufacturer: HRE(芯声); JLCPCB Part Class: Extended Part; Contributor: lcsc
C3 C4 = 600F330JT250XT: Supplier: LCSC; Supplier Part: C3838790; Manufacturer: Kyocera AVX; Contributor: lcsc; JLCPCB Part Class: Extended Part
C5 = 0.47uF 50V 4*5: Supplier: LCSC; Manufacturer: Chengx(承兴); Manufacturer Part: kF474M050C05RR0VH2FP0; Supplier Part: C45095; JLCPCB Part Class: Extended Part
C6 = ECR1HPT330MLL063011: Contributor: LCSC; Supplier: LCSC; Supplier Part: C216549; Manufacturer: Jianghai(南通江海); JLCPCB Part Class: Extended Part
DIP1 = DIP switchEI-08: Supplier: LCSC; Manufacturer: Diptronics(圜达); Manufacturer Part: EI-08-V; Supplier Part: C90019; JLCPCB Part Class: Extended Part
J1 = HDR-M-2.54_1x10: Supplier Part: C42391526; Supplier: LCSC; Manufacturer: hanxia(韩下); Manufacturer Part: HX PZ-2005WV-1x10P; Contributor: LCEDA_Lib
J2 = HDR-M-2.54_1x3: Supplier Part: C54557117; Supplier: LCSC; Manufacturer: HDGC(华德共创); Manufacturer Part: 5557WRF-1X3P(HDGC4201WR-F-1X3P); Contributor: LCEDA_Lib
J3 = HDR-M-2.54_1x2: Supplier Part: C124375; Supplier: LCSC; Contributor: LCEDA_Lib
LED1-LED256 = 42-21A/GHC-YX1Y2N/1T: Contributor: lcsc; Supplier: LCSC; Supplier Part: C131211; Manufacturer: EVERLIGHT(亿光); JLCPCB Part Class: Extended Part
Q1-Q16 = IRLZ44NPBF-MNS: Supplier: LCSC; Supplier Part: C54839582; Manufacturer: minos(迈诺斯); Contributor: lcsc; JLCPCB Part Class: Extended Part
Q17 Q19-Q33 = AO3401CI-ES: Supplier: LCSC; Supplier Part: C21713833; Manufacturer: ElecSuper(静芯); JLCPCB Part Class: Extended Part; Contributor: lcsc
Q18 = 2N7000-TA: Contributor: LCSC; Supplier: LCSC; Supplier Part: C2910414; Manufacturer: CJ(江苏长电/长晶); JLCPCB Part Class: Extended Part
R1-R18 R20 R21 R23 R25 R26 R28 R32 R33 R35-R37 R39 R41 R43-R48 R50-R53 R55-R59 R61 R63 R65 R67 R69 = R_0603_EU: Supplier Part: C3356784; Supplier: LCSC; Contributor: LCEDA_Lib; Manufacturer Part: MFR-12FTF52-10K; Manufacturer: YAGEO(国巨)
R19 R22 R24 R27 R31 R34 R38 R40 R42 R49 R54 R60 R62 R64 R66 R68 = MF1/4W-15Ω±1% T52: Contributor: LCSC; Supplier: LCSC; Supplier Part: C119285; Manufacturer: CCO(千志电子); Manufacturer Part: MF1/4W-15Ω±1% T; JLCPCB Part Class: Extended Part
R29 = R_0603_EU: Supplier Part: C3000673; Supplier: LCSC; Contributor: LCEDA_Lib; Manufacturer Part: FRC2512F1004TS; Manufacturer: FOJAN(富捷)
R30 = R_0603_EU: Supplier Part: C20611863; Supplier: LCSC; Contributor: LCEDA_Lib; Manufacturer Part: MF0204FTE52-2K2; Manufacturer: YAGEO(国巨)
SW1 = DIP switchEI-04: Supplier: LCSC; Manufacturer: 圜达; Manufacturer Part: 拨码开关EI-04; Supplier Part: C99987; JLCPCB Part Class: Extended Part
U1 = XL74HC4514D: Supplier: LCSC; Supplier Part: C50202050; Manufacturer: XINLUDA(信路达); Contributor: lcsc; JLCPCB Part Class: Extended Part
U2 = CD74HC4060M96: Supplier: LCSC; Manufacturer: TI(德州仪器); Supplier Part: C134017; JLCPCB Part Class: Extended Part
U3 U5 = 74LVC541AD-Q100J: Contributor: LCSC; Supplier: LCSC; Supplier Part: C548810; Manufacturer: Nexperia(安世); JLCPCB Part Class: Extended Part
U4 = SN74HC590ADR: Contributor: LCSC; Supplier: LCSC; Supplier Part: C2652997; Manufacturer: TI(德州仪器); JLCPCB Part Class: Extended Part
U6 = AT28C256-15PU: Contributor: LCSC; Supplier: LCSC; Supplier Part: C1348752; Manufacturer: MICROCHIP(美国微芯); JLCPCB Part Class: Extended Part
U7 = LM3940IMPX-3.3/NOPB: Contributor: LCSC; Supplier: LCSC; Supplier Part: C544820; Manufacturer: TI(德州仪器); JLCPCB Part Class: Extended Part
X1 = CD02K032768ACNBAEAE: Supplier: LCSC; Supplier Part: C907564; Manufacturer: TKD(泰晶); JLCPCB Part Class: Extended Part; Contributor: lcsc

## Nets
+3.3V: C6.1 Q17.2(S) Q19.2(S) Q20.2(S) Q21.2(S) Q22.2(S) Q23.2(S) Q24.2(S) Q25.2(S) Q26.2(S) Q27.2(S) Q28.2(S) Q29.2(S) Q30.2(S) Q31.2(S) Q32.2(S) Q33.2(S) R1.1 R2.1 R3.1 R4.1 R5.1 R6.1 R7.1 R8.1 R9.1 R10.1 R11.1 R12.1 R13.1 R14.1 R15.1 R16.1 R17.1 R20.2 R21.2 R23.2 R25.2 R32.2 R36.2 R39.2 R41.2 R45.2 R53.2 R57.2 R61.2 R63.2 R65.2 R67.2 R69.2 U3.20(VCC) U5.20(VCC) U7.3(OUT)
+5V: C1.2 C2.2 C5.1 DIP1.1 DIP1.2 DIP1.3 DIP1.4 DIP1.5 DIP1.6 DIP1.7 DIP1.8 J3.2 R28.2 R33.2 SW1.1 SW1.2 SW1.3 SW1.4 U1.1(LE) U1.24(VCC) U2.16(VCC) U4.16(VCC) U6.28(Vcc) U7.1(IN)
GND: C1.1 C2.1 C3.1 C4.1 C5.2 C6.2 J3.1 Q1.3(S) Q2.3(S) Q3.3(S) Q4.3(S) Q5.3(S) Q6.3(S) Q7.3(S) Q8.3(S) Q9.3(S) Q10.3(S) Q11.3(S) Q12.3(S) Q13.3(S) Q14.3(S) Q15.3(S) Q16.3(S) Q18.1(SOURCE) R18.1 R26.1 R35.2 R37.2 R43.2 R44.2 R46.2 R47.2 R48.2 R50.2 R51.2 R52.2 R55.2 R56.2 R58.2 R59.2 U1.12(GND) U1.23(E#) U2.8(GND) U3.10(GND) U3.19(OE2#) U4.8(GND) U5.10(GND) U5.19(OE2#) U6.14(GND) U7.2(GND) U7.4(GND)
1: LED1.2(A) LED2.2(A) LED3.2(A) LED4.2(A) LED5.2(A) LED6.2(A) LED7.2(A) LED8.2(A) LED9.2(A) LED10.2(A) LED11.2(A) LED12.2(A) LED13.2(A) LED14.2(A) LED15.2(A) LED16.2(A) R19.2
2: LED17.2(A) LED18.2(A) LED19.2(A) LED20.2(A) LED21.2(A) LED22.2(A) LED23.2(A) LED24.2(A) LED25.2(A) LED26.2(A) LED27.2(A) LED28.2(A) LED29.2(A) LED30.2(A) LED31.2(A) LED32.2(A) R22.2
3: LED33.2(A) LED34.2(A) LED35.2(A) LED36.2(A) LED37.2(A) LED38.2(A) LED39.2(A) LED40.2(A) LED41.2(A) LED42.2(A) LED43.2(A) LED44.2(A) LED45.2(A) LED46.2(A) LED47.2(A) LED48.2(A) R24.2
4: LED49.2(A) LED50.2(A) LED51.2(A) LED52.2(A) LED53.2(A) LED54.2(A) LED55.2(A) LED56.2(A) LED57.2(A) LED58.2(A) LED59.2(A) LED60.2(A) LED61.2(A) LED62.2(A) LED63.2(A) LED64.2(A) R27.2
5: LED65.2(A) LED66.2(A) LED67.2(A) LED68.2(A) LED69.2(A) LED70.2(A) LED71.2(A) LED72.2(A) LED73.2(A) LED74.2(A) LED75.2(A) LED76.2(A) LED77.2(A) LED78.2(A) LED79.2(A) LED80.2(A) R31.2
6: LED81.2(A) LED82.2(A) LED83.2(A) LED84.2(A) LED85.2(A) LED86.2(A) LED87.2(A) LED88.2(A) LED89.2(A) LED90.2(A) LED91.2(A) LED92.2(A) LED93.2(A) LED94.2(A) LED95.2(A) LED96.2(A) R34.2
7: LED97.2(A) LED98.2(A) LED99.2(A) LED100.2(A) LED101.2(A) LED102.2(A) LED103.2(A) LED104.2(A) LED105.2(A) LED106.2(A) LED107.2(A) LED108.2(A) LED109.2(A) LED110.2(A) LED111.2(A) LED112.2(A) R38.2
8: LED113.2(A) LED114.2(A) LED115.2(A) LED116.2(A) LED117.2(A) LED118.2(A) LED119.2(A) LED120.2(A) LED121.2(A) LED122.2(A) LED123.2(A) LED124.2(A) LED125.2(A) LED126.2(A) LED127.2(A) LED128.2(A) R40.2
9: LED129.2(A) LED130.2(A) LED131.2(A) LED132.2(A) LED133.2(A) LED134.2(A) LED135.2(A) LED136.2(A) LED137.2(A) LED138.2(A) LED139.2(A) LED140.2(A) LED141.2(A) LED142.2(A) LED143.2(A) LED144.2(A) R42.2
10: LED145.2(A) LED146.2(A) LED147.2(A) LED148.2(A) LED149.2(A) LED150.2(A) LED151.2(A) LED152.2(A) LED153.2(A) LED154.2(A) LED155.2(A) LED156.2(A) LED157.2(A) LED158.2(A) LED159.2(A) LED160.2(A) R49.2
11: LED161.2(A) LED162.2(A) LED163.2(A) LED164.2(A) LED165.2(A) LED166.2(A) LED167.2(A) LED168.2(A) LED169.2(A) LED170.2(A) LED171.2(A) LED172.2(A) LED173.2(A) LED174.2(A) LED175.2(A) LED176.2(A) R54.2
12: LED177.2(A) LED178.2(A) LED179.2(A) LED180.2(A) LED181.2(A) LED182.2(A) LED183.2(A) LED184.2(A) LED185.2(A) LED186.2(A) LED187.2(A) LED188.2(A) LED189.2(A) LED190.2(A) LED191.2(A) LED192.2(A) R60.2
13: LED193.2(A) LED194.2(A) LED195.2(A) LED196.2(A) LED197.2(A) LED198.2(A) LED199.2(A) LED200.2(A) LED201.2(A) LED202.2(A) LED203.2(A) LED204.2(A) LED205.2(A) LED206.2(A) LED207.2(A) LED208.2(A) R62.2
14: LED209.2(A) LED210.2(A) LED211.2(A) LED212.2(A) LED213.2(A) LED214.2(A) LED215.2(A) LED216.2(A) LED217.2(A) LED218.2(A) LED219.2(A) LED220.2(A) LED221.2(A) LED222.2(A) LED223.2(A) LED224.2(A) R64.2
15: LED225.2(A) LED226.2(A) LED227.2(A) LED228.2(A) LED229.2(A) LED230.2(A) LED231.2(A) LED232.2(A) LED233.2(A) LED234.2(A) LED235.2(A) LED236.2(A) LED237.2(A) LED238.2(A) LED239.2(A) LED240.2(A) R66.2
16: LED241.2(A) LED242.2(A) LED243.2(A) LED244.2(A) LED245.2(A) LED246.2(A) LED247.2(A) LED248.2(A) LED249.2(A) LED250.2(A) LED251.2(A) LED252.2(A) LED253.2(A) LED254.2(A) LED255.2(A) LED256.2(A) R68.2
A: LED1.1(K) LED17.1(K) LED33.1(K) LED49.1(K) LED65.1(K) LED81.1(K) LED97.1(K) LED113.1(K) LED129.1(K) LED145.1(K) LED161.1(K) LED177.1(K) LED193.1(K) LED209.1(K) LED225.1(K) LED241.1(K) Q1.2(D) R1.2
B: LED2.1(K) LED18.1(K) LED34.1(K) LED50.1(K) LED66.1(K) LED82.1(K) LED98.1(K) LED114.1(K) LED130.1(K) LED146.1(K) LED162.1(K) LED178.1(K) LED194.1(K) LED210.1(K) LED226.1(K) LED242.1(K) Q2.2(D) R2.2
C: LED3.1(K) LED19.1(K) LED35.1(K) LED51.1(K) LED67.1(K) LED83.1(K) LED99.1(K) LED115.1(K) LED131.1(K) LED147.1(K) LED163.1(K) LED179.1(K) LED195.1(K) LED211.1(K) LED227.1(K) LED243.1(K) Q3.2(D) R3.2
D: LED4.1(K) LED20.1(K) LED36.1(K) LED52.1(K) LED68.1(K) LED84.1(K) LED100.1(K) LED116.1(K) LED132.1(K) LED148.1(K) LED164.1(K) LED180.1(K) LED196.1(K) LED212.1(K) LED228.1(K) LED244.1(K) Q4.2(D) R4.2
E: LED5.1(K) LED21.1(K) LED37.1(K) LED53.1(K) LED69.1(K) LED85.1(K) LED101.1(K) LED117.1(K) LED133.1(K) LED149.1(K) LED165.1(K) LED181.1(K) LED197.1(K) LED213.1(K) LED229.1(K) LED245.1(K) Q5.2(D) R5.2
F: LED6.1(K) LED22.1(K) LED38.1(K) LED54.1(K) LED70.1(K) LED86.1(K) LED102.1(K) LED118.1(K) LED134.1(K) LED150.1(K) LED166.1(K) LED182.1(K) LED198.1(K) LED214.1(K) LED230.1(K) LED246.1(K) Q6.2(D) R6.2
G: LED7.1(K) LED23.1(K) LED39.1(K) LED55.1(K) LED71.1(K) LED87.1(K) LED103.1(K) LED119.1(K) LED135.1(K) LED151.1(K) LED167.1(K) LED183.1(K) LED199.1(K) LED215.1(K) LED231.1(K) LED247.1(K) Q7.2(D) R7.2
H: LED8.1(K) LED24.1(K) LED40.1(K) LED56.1(K) LED72.1(K) LED88.1(K) LED104.1(K) LED120.1(K) LED136.1(K) LED152.1(K) LED168.1(K) LED184.1(K) LED200.1(K) LED216.1(K) LED232.1(K) LED248.1(K) Q8.2(D) R8.2
I: LED9.1(K) LED25.1(K) LED41.1(K) LED57.1(K) LED73.1(K) LED89.1(K) LED105.1(K) LED121.1(K) LED137.1(K) LED153.1(K) LED169.1(K) LED185.1(K) LED201.1(K) LED217.1(K) LED233.1(K) LED249.1(K) Q9.2(D) R9.2
J: LED10.1(K) LED26.1(K) LED42.1(K) LED58.1(K) LED74.1(K) LED90.1(K) LED106.1(K) LED122.1(K) LED138.1(K) LED154.1(K) LED170.1(K) LED186.1(K) LED202.1(K) LED218.1(K) LED234.1(K) LED250.1(K) Q10.2(D) R10.2
K: LED11.1(K) LED27.1(K) LED43.1(K) LED59.1(K) LED75.1(K) LED91.1(K) LED107.1(K) LED123.1(K) LED139.1(K) LED155.1(K) LED171.1(K) LED187.1(K) LED203.1(K) LED219.1(K) LED235.1(K) LED251.1(K) Q11.2(D) R11.2
L: LED12.1(K) LED28.1(K) LED44.1(K) LED60.1(K) LED76.1(K) LED92.1(K) LED108.1(K) LED124.1(K) LED140.1(K) LED156.1(K) LED172.1(K) LED188.1(K) LED204.1(K) LED220.1(K) LED236.1(K) LED252.1(K) Q12.2(D) R12.2
M: LED13.1(K) LED29.1(K) LED45.1(K) LED61.1(K) LED77.1(K) LED93.1(K) LED109.1(K) LED125.1(K) LED141.1(K) LED157.1(K) LED173.1(K) LED189.1(K) LED205.1(K) LED221.1(K) LED237.1(K) LED253.1(K) Q13.2(D) R13.2
N: LED14.1(K) LED30.1(K) LED46.1(K) LED62.1(K) LED78.1(K) LED94.1(K) LED110.1(K) LED126.1(K) LED142.1(K) LED158.1(K) LED174.1(K) LED190.1(K) LED206.1(K) LED222.1(K) LED238.1(K) LED254.1(K) Q14.2(D) R14.2
O: LED15.1(K) LED31.1(K) LED47.1(K) LED63.1(K) LED79.1(K) LED95.1(K) LED111.1(K) LED127.1(K) LED143.1(K) LED159.1(K) LED175.1(K) LED191.1(K) LED207.1(K) LED223.1(K) LED239.1(K) LED255.1(K) Q15.2(D) R15.2
P: LED16.1(K) LED32.1(K) LED48.1(K) LED64.1(K) LED80.1(K) LED96.1(K) LED112.1(K) LED128.1(K) LED144.1(K) LED160.1(K) LED176.1(K) LED192.1(K) LED208.1(K) LED224.1(K) LED240.1(K) LED256.1(K) Q16.2(D) R16.2
Net-(C3-2): C3.2 R29.1 U2.11(φI) X1.1
Net-(C4-2): C4.2 R30.1 X1.2
Net-(DIP1-9): DIP1.9 R52.1 U6.3(A7)
Net-(DIP1-10): DIP1.10 R51.1 U6.25(A8)
Net-(DIP1-11): DIP1.11 R50.1 U6.24(A9)
Net-(DIP1-12): DIP1.12 R48.1 U6.21(A10)
Net-(DIP1-13): DIP1.13 R47.1 U6.23(A11)
Net-(DIP1-14): DIP1.14 R46.1 U6.2(A12)
Net-(DIP1-15): DIP1.15 R44.1 U6.26(A13)
Net-(DIP1-16): DIP1.16 R43.1 U6.1(A14)
Net-(J1-1): J1.1 U2.7(Q4)
Net-(J1-2): J1.2 U2.5(Q5)
Net-(J1-3): J1.3 U2.4(Q6)
Net-(J1-4): J1.4 U2.6(Q7)
Net-(J1-5): J1.5 U2.14(Q8)
Net-(J1-6): J1.6 U2.13(Q9)
Net-(J1-7): J1.7 U2.15(Q10)
Net-(J1-8): J1.8 U2.1(Q12)
Net-(J1-9): J1.9 U2.2(Q13)
Net-(J1-10): J1.10 U2.3(Q14)
Net-(J2-1): J2.1 U4.7(QH)
Net-(J2-2): J2.2 U4.6(QG)
Net-(J2-3): J2.3 U4.5(QF)
Net-(Q1-1): Q1.1(G) U1.11(Q0)
Net-(Q2-1): Q2.1(G) U1.9(Q1)
Net-(Q3-1): Q3.1(G) U1.10(Q2)
Net-(Q4-1): Q4.1(G) U1.8(Q3)
Net-(Q5-1): Q5.1(G) U1.7(Q4)
Net-(Q6-1): Q6.1(G) U1.6(Q5)
Net-(Q7-1): Q7.1(G) U1.5(Q6)
Net-(Q8-1): Q8.1(G) U1.4(Q7)
Net-(Q9-1): Q9.1(G) U1.18(Q8)
Net-(Q10-1): Q10.1(G) U1.17(Q9)
Net-(Q11-1): Q11.1(G) U1.20(Q10)
Net-(Q12-1): Q12.1(G) U1.19(Q11)
Net-(Q13-1): Q13.1(G) U1.14(Q12)
Net-(Q14-1): Q14.1(G) U1.13(Q13)
Net-(Q15-1): Q15.1(G) U1.16(Q14)
Net-(Q16-1): Q16.1(G) U1.15(Q15)
Net-(Q17-1): Q17.1(G) R17.2 U3.18(Y0)
Net-(Q17-3): Q17.3(D) R19.1
Net-(Q18-2): Q18.2(GATE) U4.15(QA) U5.1(OE1#) U6.10(A0)
Net-(Q18-3): Q18.3(DRAIN) R21.1 U3.1(OE1#)
Net-(Q19-1): Q19.1(G) R20.1 U3.17(Y1)
Net-(Q19-3): Q19.3(D) R22.1
Net-(Q20-1): Q20.1(G) R23.1 U3.16(Y2)
Net-(Q20-3): Q20.3(D) R24.1
Net-(Q21-1): Q21.1(G) R25.1 U3.15(Y3)
Net-(Q21-3): Q21.3(D) R27.1
Net-(Q22-1): Q22.1(G) R69.1 U3.14(Y4)
Net-(Q22-3): Q22.3(D) R31.1
Net-(Q23-1): Q23.1(G) R32.1 U3.13(Y5)
Net-(Q23-3): Q23.3(D) R34.1
Net-(Q24-1): Q24.1(G) R36.1 U3.12(Y6)
Net-(Q24-3): Q24.3(D) R38.1
Net-(Q25-1): Q25.1(G) R39.1 U3.11(Y7)
Net-(Q25-3): Q25.3(D) R40.1
Net-(Q26-1): Q26.1(G) R41.1 U5.18(Y0)
Net-(Q26-3): Q26.3(D) R42.1
Net-(Q27-1): Q27.1(G) R45.1 U5.17(Y1)
Net-(Q27-3): Q27.3(D) R49.1
Net-(Q28-1): Q28.1(G) R53.1 U5.16(Y2)
Net-(Q28-3): Q28.3(D) R54.1
Net-(Q29-1): Q29.1(G) R57.1 U5.15(Y3)
Net-(Q29-3): Q29.3(D) R60.1
Net-(Q30-1): Q30.1(G) R61.1 U5.14(Y4)
Net-(Q30-3): Q30.3(D) R62.1
Net-(Q31-1): Q31.1(G) R63.1 U5.13(Y5)
Net-(Q31-3): Q31.3(D) R64.1
Net-(Q32-1): Q32.1(G) R65.1 U5.12(Y6)
Net-(Q32-3): Q32.3(D) R66.1
Net-(Q33-1): Q33.1(G) R67.1 U5.11(Y7)
Net-(Q33-3): Q33.3(D) R68.1
Net-(R18-2): R18.2 U2.12(MR)
Net-(R26-2): R26.2 U4.12(CCKEN#) U4.14(OE#)
Net-(R28-1): R28.1 U4.10(CCLR#)
Net-(R29-2): R29.2 R30.2 U2.10(φO#)
Net-(R33-1): R33.1 U6.27(WE#)
Net-(R35-1): R35.1 U6.22(OE#)
Net-(R37-1): R37.1 U6.20(CE#)
Net-(R55-1): R55.1 SW1.8 U6.4(A6)
Net-(R56-1): R56.1 SW1.7 U6.5(A5)
Net-(R58-1): R58.1 SW1.6
Net-(R59-1): R59.1 SW1.5
Net-(U1-2): U1.2(A0) U4.1(QB) U6.9(A1)
Net-(U1-3): U1.3(A1) U4.2(QC) U6.8(A2)
Net-(U1-21): U1.21(A2) U4.3(QD) U6.7(A3)
Net-(U1-22): U1.22(A3) U4.4(QE) U6.6(A4)
Net-(U2-9): U2.9(φO) U4.11(CCLK) U4.13(RCLK)
Net-(U3-2): U3.2(A0) U5.2(A0) U6.11(I/O0)
Net-(U3-3): U3.3(A1) U5.3(A1) U6.12(I/O1)
Net-(U3-4): U3.4(A2) U5.4(A2) U6.13(I/O2)
Net-(U3-5): U3.5(A3) U5.5(A3) U6.15(I/O3)
Net-(U3-6): U3.6(A4) U5.6(A4) U6.16(I/O4)
Net-(U3-7): U3.7(A5) U5.7(A5) U6.17(I/O5)
Net-(U3-8): U3.8(A6) U5.8(A6) U6.18(I/O6)
Net-(U3-9): U3.9(A7) U5.9(A7) U6.19(I/O7)

Not connected (* = marked no-connect by the designer): U4 9(RCO#)*
